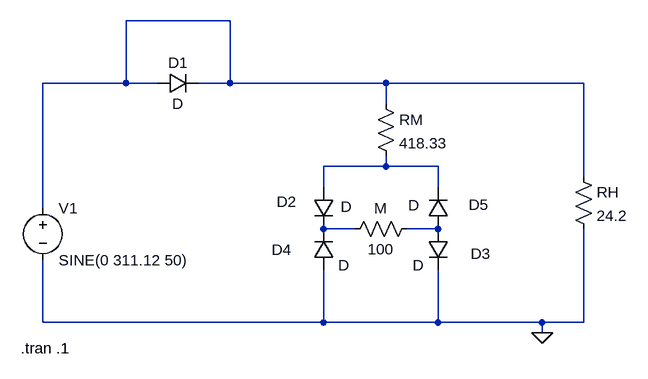
[diagram p0: schematic Problema 3 TP1.1.asc]
Problema 3 TP1.1.asc, the LTspice schematic file:
Version 4
SHEET 1 1092 680
WIRE 288 -160 128 -160
WIRE 128 -64 128 -160
WIRE 128 -64 0 -64
WIRE 176 -64 128 -64
WIRE 288 -64 288 -160
WIRE 288 -64 240 -64
WIRE 528 -64 288 -64
WIRE 832 -64 528 -64
WIRE 528 -32 528 -64
WIRE 528 64 528 48
WIRE 528 64 432 64
WIRE 608 64 528 64
WIRE 832 80 832 -64
WIRE 432 96 432 64
WIRE 608 96 608 64
WIRE 0 128 0 -64
WIRE 480 160 432 160
WIRE 608 160 560 160
WIRE 0 304 0 208
WIRE 432 304 432 224
WIRE 432 304 0 304
WIRE 608 304 608 224
WIRE 608 304 432 304
WIRE 768 304 608 304
WIRE 832 304 832 160
WIRE 832 304 768 304
WIRE 768 320 768 304
FLAG 768 320 0
SYMBOL voltage 0 112 R0
WINDOW 123 0 0 Left 0
WINDOW 39 0 0 Left 0
SYMATTR InstName V1
SYMATTR Value SINE(0 311.12 50)
SYMBOL diode 176 -48 R270
WINDOW 0 32 32 VTop 2
WINDOW 3 0 32 VBottom 2
SYMATTR InstName D1
SYMBOL diode 416 96 R0
WINDOW 0 -56 22 Left 2
WINDOW 3 42 30 Left 2
SYMATTR InstName D2
SYMBOL diode 592 160 R0
WINDOW 0 66 38 Left 2
WINDOW 3 -23 56 Left 2
SYMATTR InstName D3
SYMBOL diode 448 224 R180
WINDOW 0 65 32 Left 2
WINDOW 3 -24 8 Left 2
SYMATTR InstName D4
SYMBOL diode 624 160 R180
WINDOW 0 -62 37 Left 2
WINDOW 3 45 36 Left 2
SYMATTR InstName D5
SYMBOL res 576 144 R90
WINDOW 0 0 56 VBottom 2
WINDOW 3 32 56 VTop 2
SYMATTR InstName M
SYMATTR Value 100
SYMBOL res 512 -48 R0
SYMATTR InstName RM
SYMATTR Value 418.33
SYMBOL res 816 64 R0
SYMATTR InstName RH
SYMATTR Value 24.2
TEXT -34 344 Left 2 !.tran .1

The netlist it stands for:
* Problema 3 TP1.1.asc
V1 N001 0 SINE(0 311.12 50)
D1 N001 N001 D
D2 N002 N003 D
D3 N004 0 D
D4 0 N003 D
D5 N004 N002 D
R§M N004 N003 100
RM N001 N002 418.33
RH N001 0 24.2
.model D D
.lib standard.dio
.tran .1
.backanno
.end